# Altium schematic sheet boost-dc-dc.SchDoc
size A4
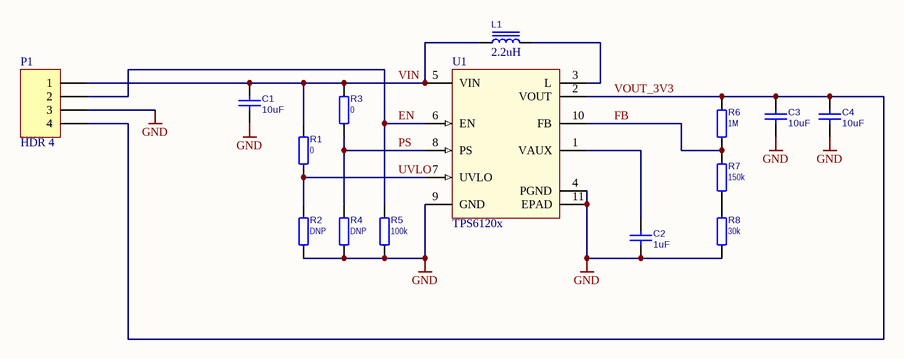
[diagram p0: boost-dc-dc.SchDoc]

## Parts
C1  value 10uF  [C0805]  (hidden comment: CAP_NPOL)
C2  value 1uF  [C0603]  (hidden comment: CAP_NPOL)
C3  value 10uF  [C0805]  (hidden comment: CAP_NPOL)
C4  value 10uF  [C0805]  (hidden comment: CAP_NPOL)
L1  value 2.2uH  [CDRH4D28]  (hidden comment: IND_W_IRON)
P1  HDR 4  [PLS-4]
R1  value 0  [R0603]  (hidden comment: RES)
R2  value DNP  [R0603]  (hidden comment: RES)
R3  value 0  [R0603]  (hidden comment: RES)
R4  value DNP  [R0603]  (hidden comment: RES)
R5  value 100k  [R0603]  (hidden comment: RES)
R6  value 1M  [R0603]  (hidden comment: RES)
R7  value 150k  [R0603]  (hidden comment: RES)
R8  value 30k  [R0603]  (hidden comment: RES)
U1  TPS6120x  [VSON-10-3x3]

## Nets
GND: C1.1 C2.1 C3.1 C4.1 P1.3 R2.1 R4.1 R5.1 R8.1 U1.4(PGND) U1.9(GND) U1.11(EPAD)
EN: P1.2 R5.2 U1.6(EN)
FB: R6.1 R7.2 U1.10(FB)
PS: R3.1 R4.2 U1.8(PS)
UVLO: R1.1 R2.2 U1.7(UVLO)
VIN: C1.2 L1.1 P1.1 R1.2 R3.2 U1.5(VIN)
VOUT_3V3: C3.2 C4.2 P1.4 R6.2 U1.2(VOUT)
NetC2_2: C2.2 U1.1(VAUX)
NetL1_2: L1.2 U1.3(L)
NetR7_1: R7.1 R8.2

## Library data of the parts
P1 = HDR 4: Header, 4-Pin; LatestRevisionDate: 17-Jul-2002; LatestRevisionNote: Re-released for DXP Platform.; Publisher: Altium Limited
R1-R8 = RESISTOR
U1 = TPS6120x: Low Input Voltage Synchronous Boost Converter / With 1.3-A Switches; value: TPS6120x